# EAGLE schematic power_dist (EAGLE 9.6.0)
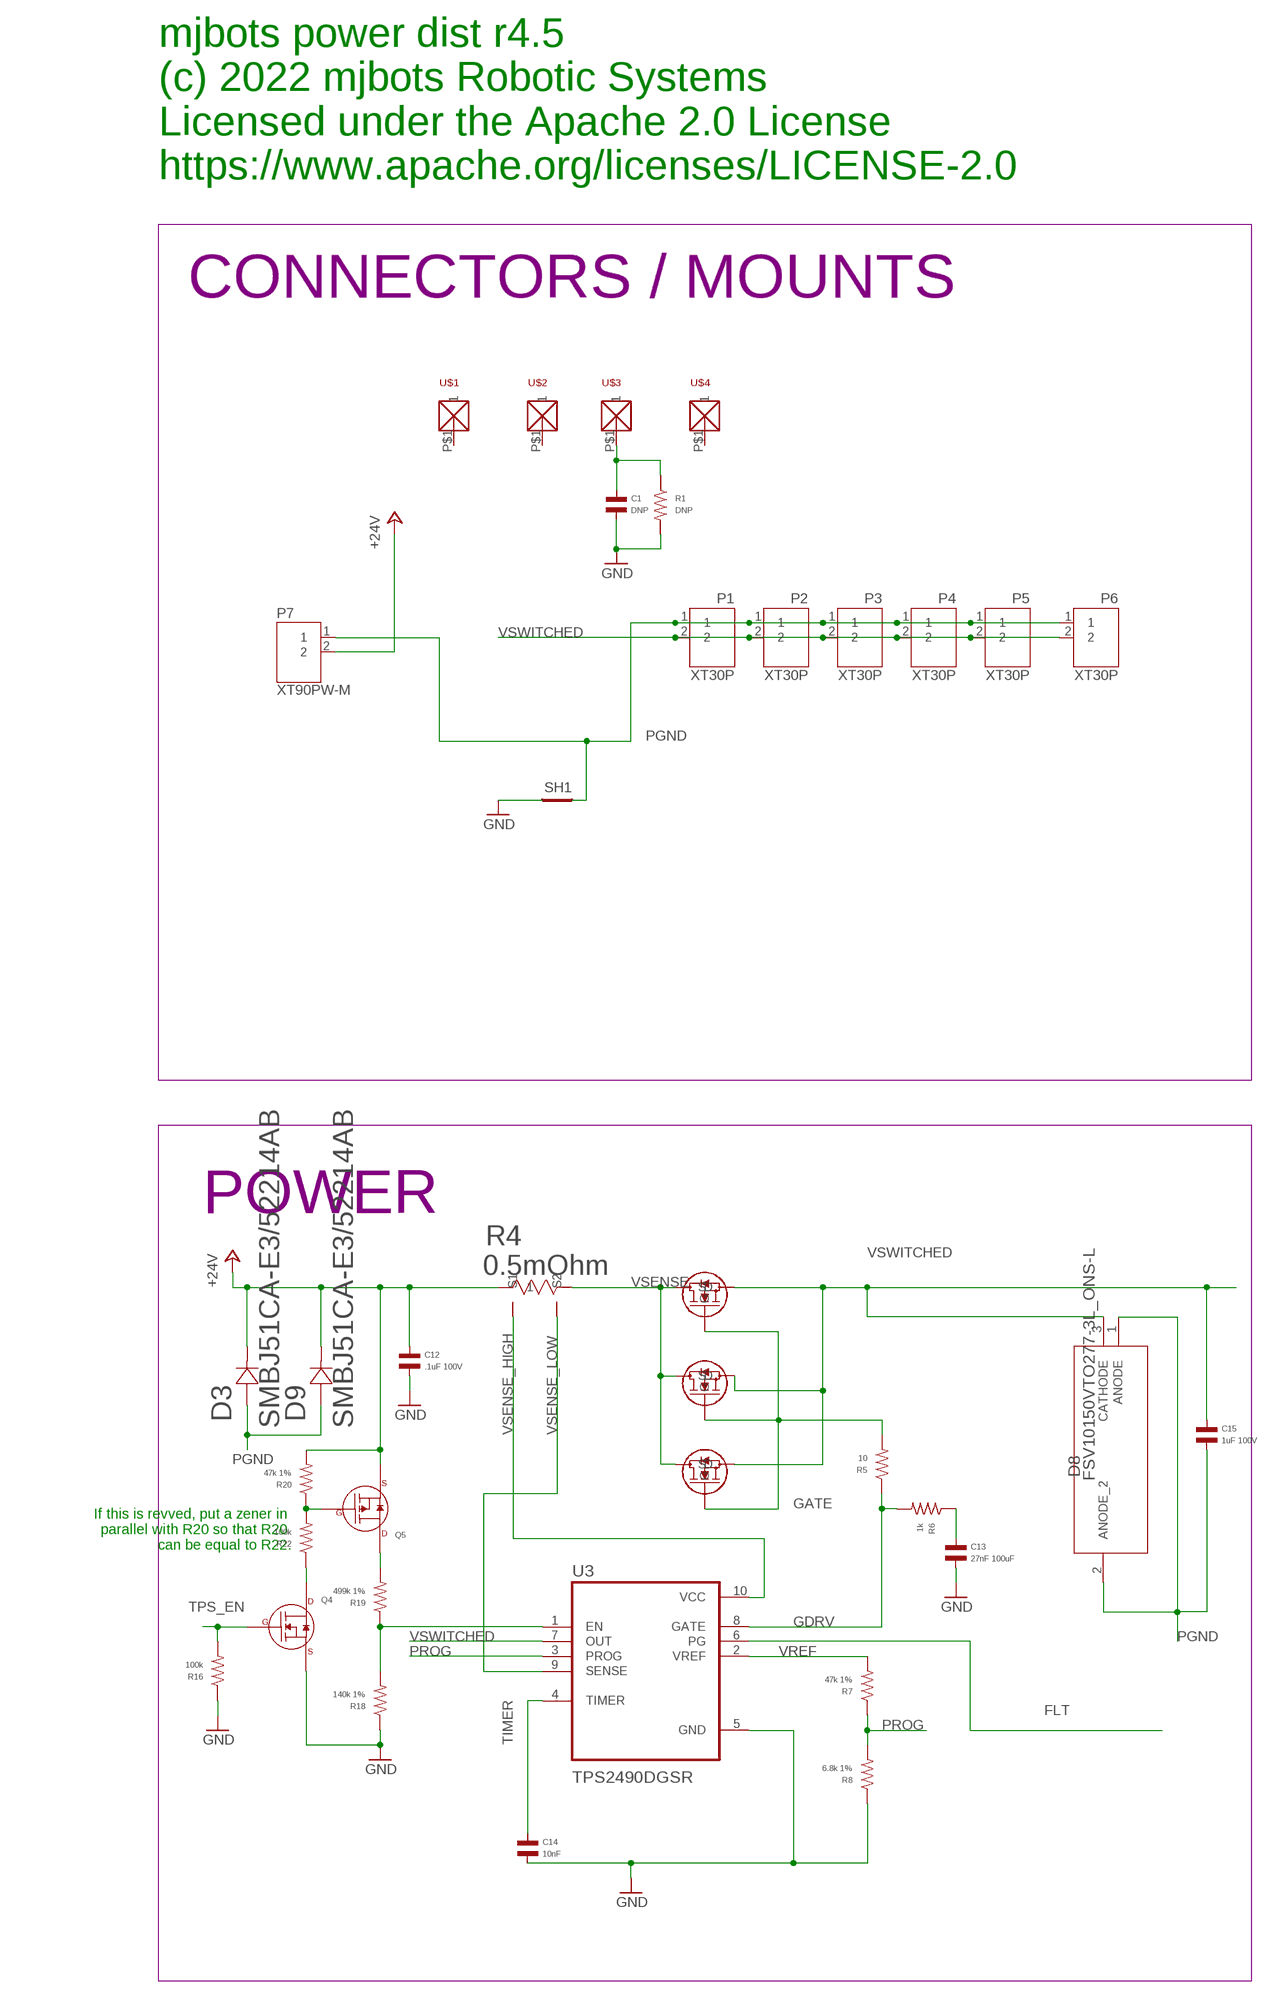
[diagram p0: schematic, sheet 1, part 1 of 2]
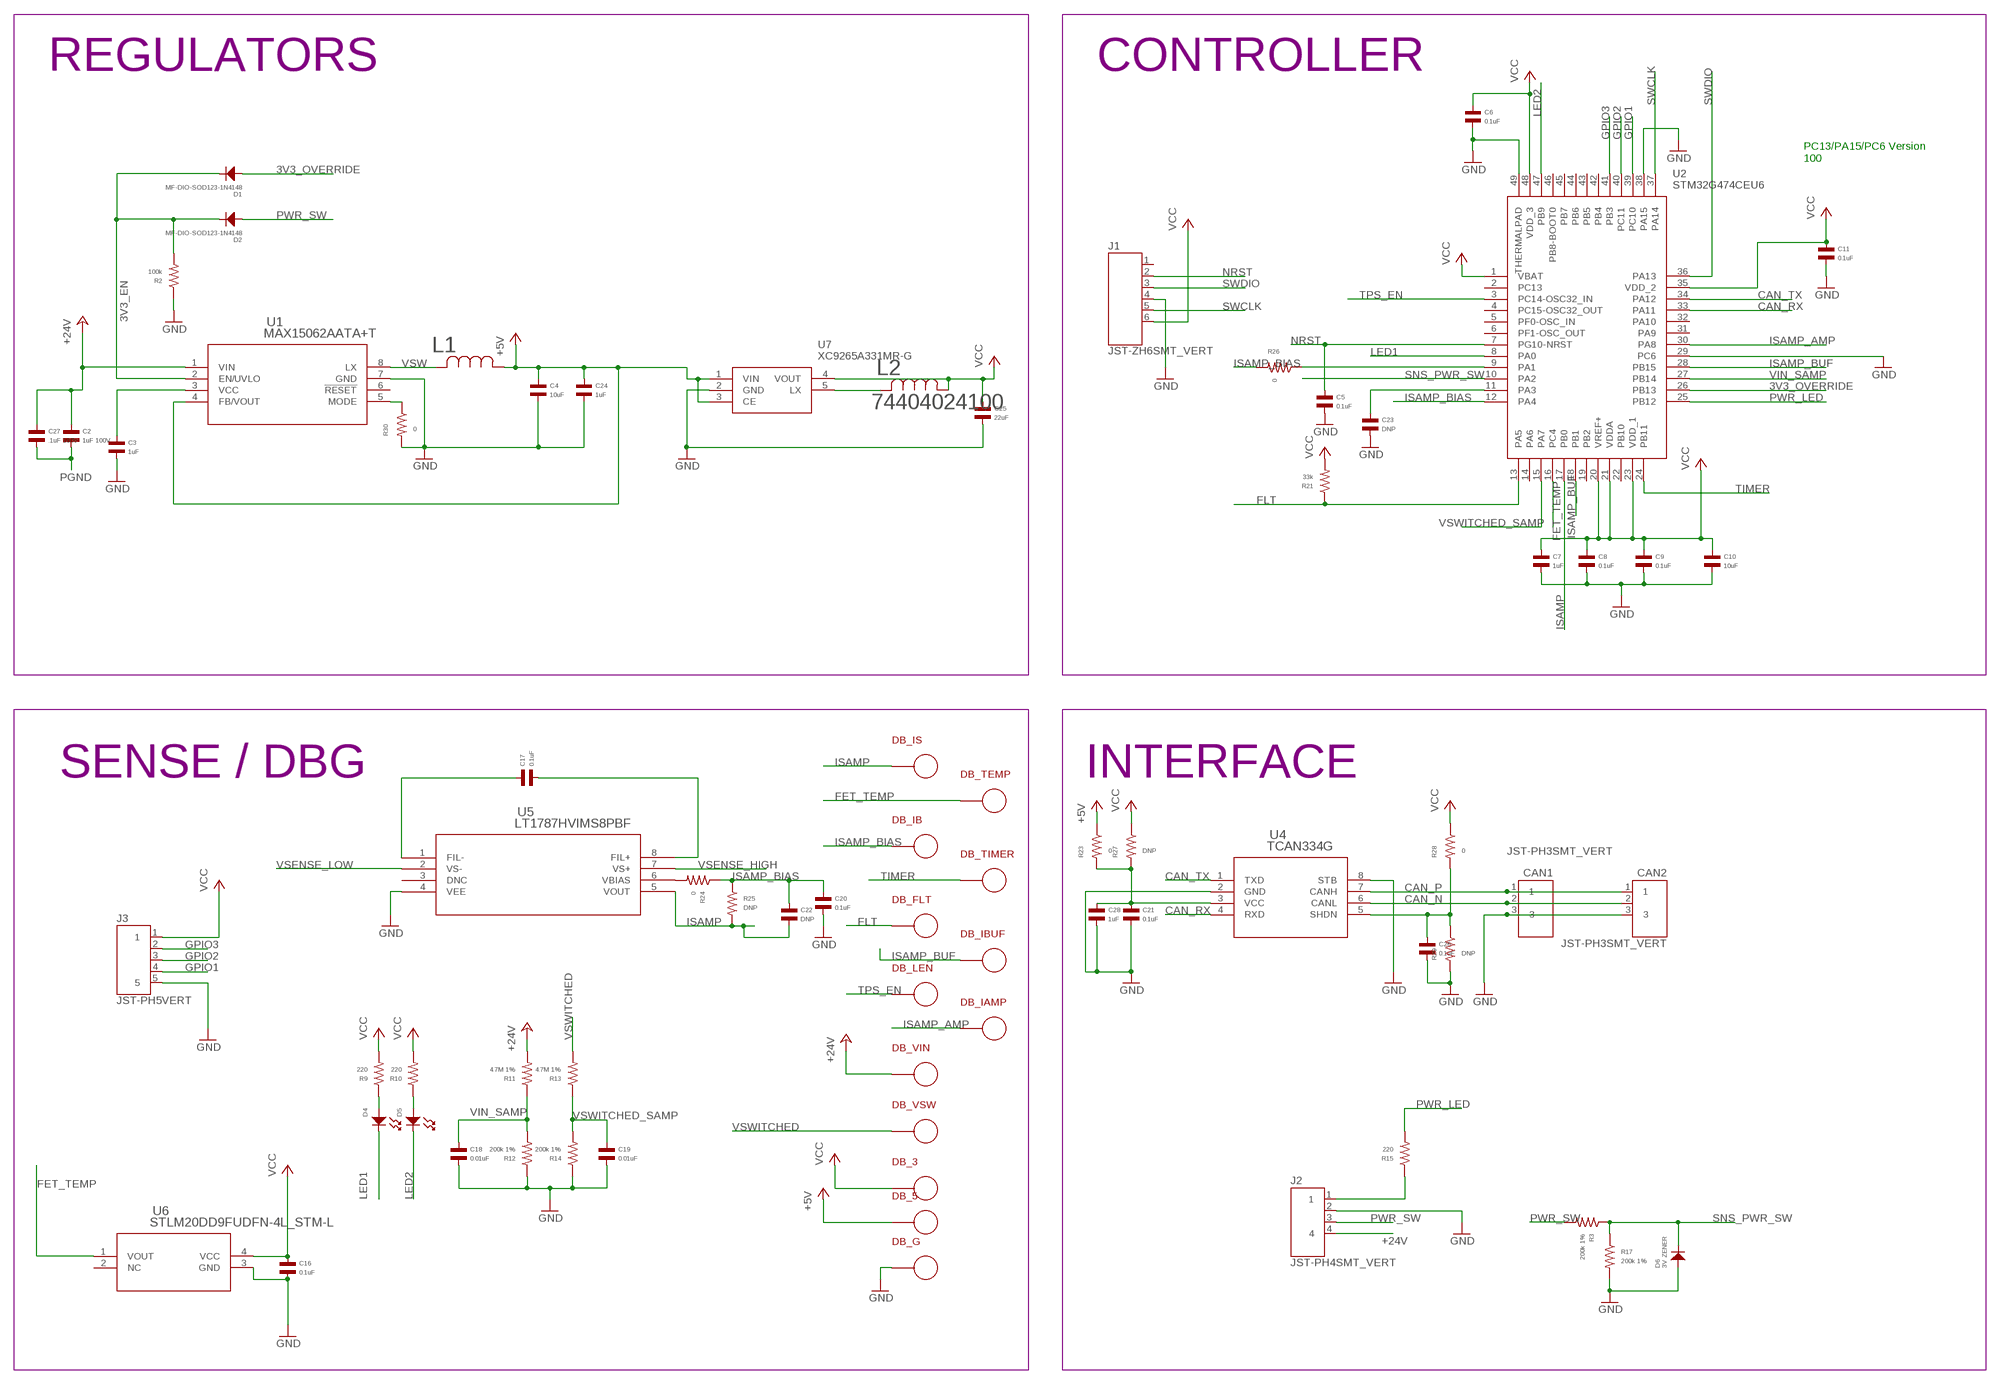
[diagram p1: schematic, sheet 1, part 2 of 2]

## Parts
C1  DNP  CAPACITOR_NP_0603  [C0603]
C2  1uF 100V  CAPACITOR_NP_0805  [C0805]
C3  1uF  CAPACITOR_NP_0603  [C0603]
C4  10uF  CAPACITOR_NP_1206  [C1206]
C5  0.1uF  CAPACITOR_NP_0603  [C0603]
C6  0.1uF  CAPACITOR_NP_0603  [C0603]
C7  1uF  CAPACITOR_NP_0603  [C0603]
C8  0.1uF  CAPACITOR_NP_0603  [C0603]
C9  0.1uF  CAPACITOR_NP_0603  [C0603]
C10  10uF  CAPACITOR_NP_1206  [C1206]
C11  0.1uF  CAPACITOR_NP_0603  [C0603]
C12  .1uF 100V  CAPACITOR_NP_0603  [C0603]
C13  27nF 100uF  CAPACITOR_NP_0603  [C0603]
C14  10nF  CAPACITOR_NP_0603  [C0603]
C15  1uF 100V  CAPACITOR_NP_0805  [C0805]
C16  0.1uF  CAPACITOR_NP_0603  [C0603]
C17  0.1uF  CAPACITOR_NP_0603  [C0603]
C18  0.01uF  CAPACITOR_NP_0603  [C0603]
C19  0.01uF  CAPACITOR_NP_0603  [C0603]
C20  0.1uF  CAPACITOR_NP_0603  [C0603]
C21  0.1uF  CAPACITOR_NP_0603  [C0603]
C22  DNP  CAPACITOR_NP_0603  [C0603]
C23  DNP  CAPACITOR_NP_0603  [C0603]
C24  1uF  CAPACITOR_NP_0402  [C0402]
C25  22uF  CAPACITOR_NP_1206  [C1206]
C26  0.1uF  CAPACITOR_NP_0603  [C0603]
C27  .1uF 100V  CAPACITOR_NP_0603  [C0603]
C28  1uF  CAPACITOR_NP_0603  [C0603]
CAN1  JST-PH3SMT_VERT  [JST_B3B_PH-SM4-TB(LF)(SN)]
CAN2  JST-PH3SMT_VERT  [JST_B3B_PH-SM4-TB(LF)(SN)]
D1  MF-DIO-SOD123-1N4148  DIODES_1N4148_SOD-123  [SOD-123]
D2  MF-DIO-SOD123-1N4148  DIODES_1N4148_SOD-123  [SOD-123]
D3  SMBJ51CA-E3/52214AB  [DIODE_DO-214AB]
D4  LED_SINGLE-0603  [LED0603]
D5  LED_SINGLE-0603  [LED0603]
D6  3V ZENER  DIODES_1N4148_SOD-123  [SOD-123]
D8  FSV10150VTO277-3L_ONS-L  [TO277-3L_ONS-L]
D9  SMBJ51CA-E3/52214AB  [DIODE_DO-214AB]
DB_3  PAD24AWG_PAD  [24AWG_PAD]
DB_5  PAD24AWG_PAD  [24AWG_PAD]
DB_FLT  PAD24AWG_PAD  [24AWG_PAD]
DB_G  PAD24AWG_PAD  [24AWG_PAD]
DB_IAMP  PAD24AWG_PAD  [24AWG_PAD]
DB_IB  PAD24AWG_PAD  [24AWG_PAD]
DB_IBUF  PAD24AWG_PAD  [24AWG_PAD]
DB_IS  PAD24AWG_PAD  [24AWG_PAD]
DB_LEN  PAD24AWG_PAD  [24AWG_PAD]
DB_TEMP  PAD24AWG_PAD  [24AWG_PAD]
DB_TIMER  PAD24AWG_PAD  [24AWG_PAD]
DB_VIN  PAD24AWG_PAD  [24AWG_PAD]
DB_VSW  PAD24AWG_PAD  [24AWG_PAD]
J1  JST-ZH6SMT_VERT  [JST_B6B-ZR-SM4-TF(LF)(SN)]
J2  JST-PH4SMT_VERT  [JST_B4B_PH-SM4-TB(LF)(SN)]
J3  JST-PH5VERT  [JST_B5B_PH-SM4-TB(LF)(SN)]
L1  SRN4018-220M  [IND_BOURNS_SRN4018]
L2  74404024100  [IND_4024100_WRE]
P1  XT30P  [XT30P]
P2  XT30P  [XT30P]
P3  XT30P  [XT30P]
P4  XT30P  [XT30P]
P5  XT30P  [XT30P]
P6  XT30P  [XT30P]
P7  XT90PW-M  [XT90PW-M]
Q1  PSMN4R8-100BSEJ  [D2PAK_SOT404_NEX]
Q2  PSMN4R8-100BSEJ  [D2PAK_SOT404_NEX]
Q3  PSMN4R8-100BSEJ  [D2PAK_SOT404_NEX]
Q4  N-CHANNEL_FET_SOT-23-3  [SOT-23-3]
Q5  P-CHANNEL_FET_SOT-23-3  [SOT-23-3]
R1  DNP  RESISTOR_0603  [R0603]
R2  100k  RESISTOR_0603  [R0603]
R3  200k 1%  RESISTOR_0603  [R0603]
R4  0.5mOhm  SENSE_RESISTOR2512  [SHUNT2512]
R5  10  RESISTOR_0603  [R0603]
R6  1k  RESISTOR_0603  [R0603]
R7  47k 1%  RESISTOR_0603  [R0603]
R8  6.8k 1%  RESISTOR_0603  [R0603]
R9  220  RESISTOR_0603  [R0603]
R10  220  RESISTOR_0603  [R0603]
R11  4.7M 1%  RESISTOR_0603  [R0603]
R12  200k 1%  RESISTOR_0603  [R0603]
R13  4.7M 1%  RESISTOR_0603  [R0603]
R14  200k 1%  RESISTOR_0603  [R0603]
R15  220  RESISTOR_0603  [R0603]
R16  100k  RESISTOR_0603  [R0603]
R17  200k 1%  RESISTOR_0603  [R0603]
R18  140k 1%  RESISTOR_0603  [R0603]
R19  499k 1%  RESISTOR_0603  [R0603]
R20  47k 1%  RESISTOR_0603  [R0603]
R21  33k  RESISTOR_0603  [R0603]
R22  100k  RESISTOR_0603  [R0603]
R23  0  RESISTOR_0603  [R0603]
R24  0  RESISTOR_0603  [R0603]
R25  DNP  RESISTOR_0603  [R0603]
R26  0  RESISTOR_0603  [R0603]
R27  DNP  RESISTOR_0603  [R0603]
R28  0  RESISTOR_0603  [R0603]
R29  DNP  RESISTOR_0603  [R0603]
R30  0  RESISTOR_0603  [R0603]
SH1  SHORTMEDIUM  [SHORT_TOP-MEDIUM]
U1  MAX15062AATA+T  [21-0487A_MXM]
U2  STM32G474CEU6  [QFN50P700X700X60-49N]
U3  TPS2490DGSR  [SOP50P490X110-10N]
U4  TCAN334G  [SOIC8]
U5  LT1787HVIMS8PBF  [MSOP-8_MS]
U6  STLM20DD9FUDFN-4L_STM-L  [UDFN-4L_STM-L]
U7  XC9265A331MR-G  [SOT95P280X130-5N]
U$1  MOUNT  [M2.5MOUNT]
U$2  MOUNT  [M2.5MOUNT]
U$3  MOUNT  [M2.5MOUNT]
U$4  MOUNT  [M2.5MOUNT]

## Nets
3V3_EN: D1.CATHODE D2.CATHODE R2.P$2 U1.2(EN/UVLO)
3V3_OVERRIDE: D1.ANODE U2.26(PB13)
+5V: C4.P$1 C24.P$1 DB_5.P$1 L1.1 R23.P$1 U1.4(FB/VOUT) U7.1(VIN) U7.3(CE)
+24V: C2.P$1 C12.P$1 C27.P$1 D3.P$1 D9.P$1 DB_VIN.P$1 J2.4 P7.2 Q5.P$2(SOURCE) R4.1 R11.P$2 R20.P$2 U1.1(VIN)
CAN_N: CAN1.2 CAN2.2 U4.6(CANL)
CAN_P: CAN1.1 CAN2.1 U4.7(CANH)
CAN_RX: U2.33(PA11) U4.4(RXD)
CAN_TX: U2.34(PA12) U4.1(TXD)
FET_TEMP: DB_TEMP.P$1 U2.16(PC4) U6.1(VOUT)
FLT: DB_FLT.P$1 R21.P$1 U2.13(PA5) U3.6(PG)
GATE: Q1.1(G) Q2.1(G) Q3.1(G) R5.P$2
GDRV: R5.P$1 R6.P$2 U3.8(GATE)
GND: C1.P$2 C3.P$2 C4.P$2 C5.P$2 C6.P$2 C7.P$2 C8.P$2 C9.P$2 C10.P$2 C11.P$2 C12.P$2 C13.P$2 C14.P$2 C16.P$2 C18.P$2 C19.P$2 C20.P$2 C21.P$2 C23.P$2 C24.P$2 C25.P$2 C26.P$2 C28.P$2 CAN1.3 CAN2.3 D6.ANODE DB_G.P$1 J1.4 J2.2 J3.5 Q4.P$2(SOURCE) R1.P$2 R2.P$1 R8.P$1 R12.P$1 R14.P$1 R16.P$1 R17.P$2 R18.P$1 R29.P$2 R30.P$2 SH1.1 U1.7(GND) U2.29(PC6) U2.38(PA15) U2.49(THERMALPAD) U3.5(GND) U4.2(GND) U4.8(STB) U5.4(VEE) U6.3(GND) U7.2(GND)
GPIO1: J3.4 U2.39(PC10)
GPIO2: J3.3 U2.40(PC11)
GPIO3: J3.2 U2.41(PB3)
ISAMP: C22.P$2 DB_IS.P$1 R25.P$2 U2.17(PB0) U5.5(VOUT)
ISAMP_AMP: DB_IAMP.P$1 U2.30(PA8)
ISAMP_BIAS: C20.P$1 C22.P$1 DB_IB.P$1 R24.P$1 R25.P$1 R26.P$2 U2.12(PA4)
ISAMP_BUF: DB_IBUF.P$1 U2.18(PB1) U2.28(PB15)
LED1: D4.CATHODE U2.8(PA0)
LED2: D5.CATHODE U2.47(PB9)
N$1: R30.P$1 U1.5(MODE)
N$2: J2.1 R15.P$1
N$3: R24.P$2 U5.6(VBIAS)
N$4: C3.P$1 U1.3(VCC)
N$5: C23.P$1 U2.11(PA3)
N$6: C17.P$1 U5.1(FIL-)
N$7: C17.P$2 U5.8(FIL+)
N$8: D4.ANODE R9.P$1
N$9: C13.P$1 R6.P$1
N$10: R26.P$1 U2.9(PA1)
N$11: Q5.P$3(DRAIN) R19.P$2
N$12: R18.P$2 R19.P$1 U3.1(EN)
N$13: Q4.P$3(DRAIN) R22.P$1
N$14: D5.ANODE R10.P$1
N$15: C1.P$1 R1.P$1 U$3.P$1
N$16: Q5.P$1(GATE) R20.P$1 R22.P$2
N$17 [power]: C21.P$1 C28.P$1 R23.P$2 R27.P$2 U4.3(VCC)
N$18: L2.2 U7.5(LX)
N$19: C26.P$1 R28.P$2 R29.P$1 U4.5(SHDN)
NRST: C5.P$1 J1.2 U2.7(PG10-NRST)
PGND: C2.P$2 C15.P$2 C27.P$2 D3.P$2 D8.1(ANODE) D8.2(ANODE_2) D9.P$2 P1.1 P2.1 P3.1 P4.1 P5.1 P6.1 P7.1 SH1.2
PROG: R7.P$1 R8.P$2 U3.3(PROG)
PWR_LED: R15.P$2 U2.25(PB12)
PWR_SW: D2.ANODE J2.3 R3.P$2
SNS_PWR_SW: D6.CATHODE R3.P$1 R17.P$1 U2.10(PA2)
SWCLK: J1.5 U2.37(PA14)
SWDIO: J1.3 U2.36(PA13)
TIMER: C14.P$1 DB_TIMER.P$1 U2.24(PB11) U3.4(TIMER)
TPS_EN: DB_LEN.P$1 Q4.P$1(GATE) R16.P$2 U2.3(PC14-OSC32_IN)
VCC [power]: C6.P$1 C7.P$1 C8.P$1 C9.P$1 C10.P$1 C11.P$1 C16.P$1 C25.P$1 DB_3.P$1 J1.6 J3.1 L2.1 R9.P$2 R10.P$2 R21.P$2 R27.P$1 R28.P$1 U2.1(VBAT) U2.20(VREF+) U2.21(VDDA) U2.23(VDD_1) U2.35(VDD_2) U2.48(VDD_3) U6.4(VCC) U7.4(VOUT)
VIN_SAMP: C18.P$1 R11.P$1 R12.P$2 U2.27(PB14)
VREF: R7.P$2 U3.2(VREF)
VSENSE: Q1.2(D) Q2.2(D) Q3.2(D) R4.2
VSENSE_HIGH: R4.3(S1) U3.10(VCC) U5.7(VS+)
VSENSE_LOW: R4.4(S2) U3.9(SENSE) U5.2(VS-)
VSW: L1.2 U1.8(LX)
VSWITCHED: C15.P$1 D8.3(CATHODE) DB_VSW.P$1 P1.2 P2.2 P3.2 P4.2 P5.2 P6.2 Q1.3(S) Q2.3(S) Q3.3(S) R13.P$2 U3.7(OUT)
VSWITCHED_SAMP: C19.P$1 R13.P$1 R14.P$2 U2.15(PA7)
Unconnected: J1.1 U1.6(!RESET) U2.2(PC13) U2.4(PC15-OSC32_OUT) U2.5(PF0-OSC_IN) U2.6(PF1-OSC_OUT) U2.14(PA6) U2.19(PB2) U2.22(PB10) U2.31(PA9) U2.32(PA10) U2.42(PB4) U2.43(PB5) U2.44(PB6) U2.45(PB7) U2.46(PB8-BOOT0) U5.3(DNC) U6.2(NC) U$1.P$1 U$2.P$1 U$4.P$1

## Notes on the sheet
- mjbots power dist r4.5
  (c) 2022 mjbots Robotic Systems
  Licensed under the Apache 2.0 License
  https://www.apache.org/licenses/LICENSE-2.0
- CONNECTORS / MOUNTS | REGULATORS | CONTROLLER
- PC13/PA15/PC6 Version
  100
- POWER | SENSE / DBG | INTERFACE
- If this is revved, put a zener in 
  parallel with R20 so that R20 
  can be equal to R22.

## Library data of the parts
C1 = mfpassives:CAPACITOR_NP: Library: MF_Passives Description: Device for Non-Polarized Capacitors. Manufacture part number (MPN) can be added via Attributes. Check https://factory.macrofab.com/parts for the house parts list.; POPULATE: 0
C2 C15 = mfpassives:CAPACITOR_NP: Library: MF_Passives Description: Device for Non-Polarized Capacitors. Manufacture part number (MPN) can be added via Attributes. Check https://factory.macrofab.com/parts for the house parts list.; MF: MURATA; MPN: GCM21BC72A105KE36L; POPULATE: 1
C3 C7 C28 = mfpassives:CAPACITOR_NP: Library: MF_Passives Description: Device for Non-Polarized Capacitors. Manufacture part number (MPN) can be added via Attributes. Check https://factory.macrofab.com/parts for the house parts list.; HOUSEPART: 1; MPN: MF-CAP-0603-1uF; POPULATE: 1
C4 C10 = mfpassives:CAPACITOR_NP: Library: MF_Passives Description: Device for Non-Polarized Capacitors. Manufacture part number (MPN) can be added via Attributes. Check https://factory.macrofab.com/parts for the house parts list.; HOUSEPART: 1; MPN: MF-CAP-1206-10uF; POPULATE: 1
C5 C6 C8 C9 C11 C16 C17 C20 C21 C26 = mfpassives:CAPACITOR_NP: Library: MF_Passives Description: Device for Non-Polarized Capacitors. Manufacture part number (MPN) can be added via Attributes. Check https://factory.macrofab.com/parts for the house parts list.; HOUSEPART: 1; MPN: MF-CAP-0603-0.1uF; POPULATE: 1
C12 C27 = mfpassives:CAPACITOR_NP: Library: MF_Passives Description: Device for Non-Polarized Capacitors. Manufacture part number (MPN) can be added via Attributes. Check https://factory.macrofab.com/parts for the house parts list.; HOUSEPART: 0; MPN: GRM188R72A104KA35D; POPULATE: 1
C13 = mfpassives:CAPACITOR_NP: Library: MF_Passives Description: Device for Non-Polarized Capacitors. Manufacture part number (MPN) can be added via Attributes. Check https://factory.macrofab.com/parts for the house parts list.; HOUSEPART: 0; MPN: C0603C273K1RAC7867; POPULATE: 1
C14 C18 C19 = mfpassives:CAPACITOR_NP: Library: MF_Passives Description: Device for Non-Polarized Capacitors. Manufacture part number (MPN) can be added via Attributes. Check https://factory.macrofab.com/parts for the house parts list.; HOUSEPART: 1; MPN: MF-CAP-0603-0.01uF; POPULATE: 1
C22 C23 = mfpassives:CAPACITOR_NP: Library: MF_Passives Description: Device for Non-Polarized Capacitors. Manufacture part number (MPN) can be added via Attributes. Check https://factory.macrofab.com/parts for the house parts list.; HOUSEPART: 1; POPULATE: 0
C24 = mfpassives:CAPACITOR_NP: Library: MF_Passives Description: Device for Non-Polarized Capacitors. Manufacture part number (MPN) can be added via Attributes. Check https://factory.macrofab.com/parts for the house parts list.; HOUSEPART: 1; MPN: MF-CAP-0402-1uF; POPULATE: 1
C25 = mfpassives:CAPACITOR_NP: Library: MF_Passives Description: Device for Non-Polarized Capacitors. Manufacture part number (MPN) can be added via Attributes. Check https://factory.macrofab.com/parts for the house parts list.; MF: Samsung; MPN: CL31B226KPHNNNE; POPULATE: 1
CAN1 CAN2 = precharge:JST-PH3; MF: JST; MPN: B3B-PH-SM4-TB(LF)(SN); POPULATE: 1
D1 D2 = mfdiscretesemi:DIODES: Library: MF_Discrete_Semiconductor Description: Device for Single Packaged Diodes.; HOUSEPART: YES; MPN: MF-DIO-SOD123-1N4148; POPULATE: 1; URL: https://factory.macrofab.com/part/MF-DIO-SOD123-1N4148
D3 D9 = power_dist:SMBJ51CA-E3/52; MPN: SMC5K51A-M3/I; POPULATE: 1
D4 D5 = mfleds:LED_SINGLE: Library: MF_LEDs Description: Device for Single LED Packages. Manufacture part number (MFG#) can be added via Attributes.; HOUSEPART: 1; MPN: MF-LED-0603-RED; POPULATE: 1
D6 = mfdiscretesemi:DIODES: Library: MF_Discrete_Semiconductor Description: Device for Single Packaged Diodes.; MPN: MMSZ4682T1G; POPULATE: 1; VALUE: MF-DIO-SOD123-1N4148
D8 = power_dist:FSV10150V; BUILT_BY: EMA_Jessica; COPYRIGHT: Copyright (C) 2018 Accelerated Designs. All rights reserved; MANUFACTURER_PART_NUMBER: FSV10150V; MPN: FSV10150V; POPULATE: 1; SOURCELIBRARY: ON_Semiconductor_2019-12-30; VENDOR: ON Semiconductor
DB_3 DB_5 DB_FLT DB_G DB_IAMP DB_IB DB_IBUF DB_IS DB_LEN DB_TEMP DB_TIMER DB_VIN DB_VSW = precharge:PAD; POPULATE: 0
J1 = precharge:JST-ZH6; MF: JST; MPN: B6B-ZR-SM4-TF(LF)(SN); POPULATE: 1
J2 = precharge:JST-PH4; MF: JST; MPN: B4B-PH-SM4-TB(LF)(SN); POPULATE: 1
J3 = power_dist:JST-PH5; MF: JST; MPN: B5B-PH-SM4-TB(LF)(SN); POPULATE: 1
L1 = controller:SRN4018-220M; MANUFACTURER_PART_NUMBER: 74404042470; MF: Wurth Electronics; MPN: 74404042470; POPULATE: 1; VENDOR: Wurth
L2 = moteus_hp:74404024100; COPYRIGHT: Copyright (C) 2022 Ultra Librarian. All rights reserved.; DIGI-KEY_PART_NUMBER_1: 732-5428-2-ND; DIGI-KEY_PART_NUMBER_2: 732-5428-1-ND; DIGI-KEY_PART_NUMBER_3: 732-5428-6-ND; MANUFACTURER_PART_NUMBER: 74404024100; MF: Wurth Electronics; MFR_NAME: Wurth Electronics; MPN: 74404024100; POPULATE: 1
P1-P6 = precharge:XT30; MF: AMASS; MPN: XT30UPB-F; POPULATE: 1
P7 = power_dist:XT90; POPULATE: 1
Q1-Q3 = power_dist:PSMN4R8-100BSEJ; BUILT_BY: EMA_Cory; COPYRIGHT: Copyright (C) 2018 Accelerated Designs. All rights reserved; DATASHEET: https://assets.nexperia.com/documents/data-sheet/PSMN4R8-100BSE.pdf; MANUFACTURER_PART_NUMBER: PSMN3R7-100BSE; MPN: PSMN3R7-100BSE; POPULATE: 1; SOURCELIBRARY: Nexperia_2020-02-27; VENDOR: Nexperia
Q4 = mfdiscretesemi:N-CHANNEL_FET: Library: MF_Discrete_Semiconductor Description: Device for Single N-Channel Mosfet. Manufacture part number (MFG#) can be added via Attributes.; HOUSEPART: NO; MPN: BSS123; POPULATE: 1
Q5 = mfdiscretesemi:P-CHANNEL_FET: Library: MF_Discrete_Semiconductor Description: Device for Single P-Channel Mosfet. Manufacture part number (MFG#) can be added via Attributes.; HOUSEPART: NO; MPN: ZXMP10A13FTA; POPULATE: 1
R1 = mfpassives:RESISTOR: Library: MF_Passives Description: Device for Resistors. Manufacture part number (MPN), Voltage, Tolerance, and Wattage Rating can be added via Attributes. Check https://factory.macrofab.com/parts for the house parts list.; POPULATE: 0
R2 R16 R22 = mfpassives:RESISTOR: Library: MF_Passives Description: Device for Resistors. Manufacture part number (MPN), Voltage, Tolerance, and Wattage Rating can be added via Attributes. Check https://factory.macrofab.com/parts for the house parts list.; HOUSEPART: 1; MPN: MF-RES-0603-100K; POPULATE: 1
R3 R12 R14 R17 = mfpassives:RESISTOR: Library: MF_Passives Description: Device for Resistors. Manufacture part number (MPN), Voltage, Tolerance, and Wattage Rating can be added via Attributes. Check https://factory.macrofab.com/parts for the house parts list.; HOUSEPART: 0; MPN: RC0603FR-07200KL; POPULATE: 1
R4 = power_dist:SENSE_RESISTOR; MF: VISHAY DALE; MPN: WSLF2512L5000FEA; POPULATE: 1
R5 = mfpassives:RESISTOR: Library: MF_Passives Description: Device for Resistors. Manufacture part number (MPN), Voltage, Tolerance, and Wattage Rating can be added via Attributes. Check https://factory.macrofab.com/parts for the house parts list.; HOUSEPART: 1; MPN: MF-RES-0603-10; POPULATE: 1
R6 = mfpassives:RESISTOR: Library: MF_Passives Description: Device for Resistors. Manufacture part number (MPN), Voltage, Tolerance, and Wattage Rating can be added via Attributes. Check https://factory.macrofab.com/parts for the house parts list.; HOUSEPART: 1; MPN: MF-RES-0603-1K; POPULATE: 1
R7 R20 = mfpassives:RESISTOR: Library: MF_Passives Description: Device for Resistors. Manufacture part number (MPN), Voltage, Tolerance, and Wattage Rating can be added via Attributes. Check https://factory.macrofab.com/parts for the house parts list.; HOUSEPART: 0; MPN: RC0603FR-0747KL; POPULATE: 1
R8 = mfpassives:RESISTOR: Library: MF_Passives Description: Device for Resistors. Manufacture part number (MPN), Voltage, Tolerance, and Wattage Rating can be added via Attributes. Check https://factory.macrofab.com/parts for the house parts list.; HOUSEPART: 0; MPN: RC0603FR-076K8L; POPULATE: 1
R9 R10 R15 = mfpassives:RESISTOR: Library: MF_Passives Description: Device for Resistors. Manufacture part number (MPN), Voltage, Tolerance, and Wattage Rating can be added via Attributes. Check https://factory.macrofab.com/parts for the house parts list.; HOUSEPART: 1; MPN: MF-RES-0603-220; POPULATE: 1
R11 R13 = mfpassives:RESISTOR: Library: MF_Passives Description: Device for Resistors. Manufacture part number (MPN), Voltage, Tolerance, and Wattage Rating can be added via Attributes. Check https://factory.macrofab.com/parts for the house parts list.; HOUSEPART: 0; MPN: RC0603FR-074M7L; POPULATE: 1
R18 = mfpassives:RESISTOR: Library: MF_Passives Description: Device for Resistors. Manufacture part number (MPN), Voltage, Tolerance, and Wattage Rating can be added via Attributes. Check https://factory.macrofab.com/parts for the house parts list.; HOUSEPART: 0; MPN: RC0603FR-07140KL; POPULATE: 1
R19 = mfpassives:RESISTOR: Library: MF_Passives Description: Device for Resistors. Manufacture part number (MPN), Voltage, Tolerance, and Wattage Rating can be added via Attributes. Check https://factory.macrofab.com/parts for the house parts list.; HOUSEPART: 0; MPN: RC0603FR-07499KL; POPULATE: 1
R21 = mfpassives:RESISTOR: Library: MF_Passives Description: Device for Resistors. Manufacture part number (MPN), Voltage, Tolerance, and Wattage Rating can be added via Attributes. Check https://factory.macrofab.com/parts for the house parts list.; HOUSEPART: 1; MPN: RC0603FR-0733KL; POPULATE: 1
R23 R24 R26 R28 R30 = mfpassives:RESISTOR: Library: MF_Passives Description: Device for Resistors. Manufacture part number (MPN), Voltage, Tolerance, and Wattage Rating can be added via Attributes. Check https://factory.macrofab.com/parts for the house parts list.; HOUSEPART: 1; MPN: MF-RES-0603-0; POPULATE: 1
R25 = mfpassives:RESISTOR: Library: MF_Passives Description: Device for Resistors. Manufacture part number (MPN), Voltage, Tolerance, and Wattage Rating can be added via Attributes. Check https://factory.macrofab.com/parts for the house parts list.; HOUSEPART: 1; POPULATE: 0
R27 R29 = mfpassives:RESISTOR: Library: MF_Passives Description: Device for Resistors. Manufacture part number (MPN), Voltage, Tolerance, and Wattage Rating can be added via Attributes. Check https://factory.macrofab.com/parts for the house parts list.; HOUSEPART: 1; MPN: MF-RES-0603-0; POPULATE: 0
SH1 = shorts:SHORT: Short between two nets; POPULATE: 0
U1 = power_dist:MAX15062AATA+T; BUILT_BY: EMA_Jessica; COPYRIGHT: Copyright (C) 2018 Accelerated Designs. All rights reserved; MANUFACTURER_PART_NUMBER: MAX15062BATA+T; MF: Maxim; MPN: MAX15062BATA+T; POPULATE: 1; REVISION: 1; SOURCELIBRARY: Maxim_DP_2018-06-12; VENDOR: Maxim Integrated Products
U2 = power_dist:STM32G474CEU6: STMICROELECTRONICS - STM32G474CEU6 - MCU, 32BIT, 170MHZ, UFQFPN-48 Source: Datasheet <https://componentsearchengine.com/Datasheets/1/STM32G474CEU6.pdf>; DESCRIPTION: STMICROELECTRONICS - STM32G474CEU6 - MCU, 32BIT, 170MHZ, UFQFPN-48; HEIGHT: 0.6mm; MANUFACTURER_NAME: STMicroelectronics; MANUFACTURER_PART_NUMBER: STM32G474CEU6; MF: ST; MOUSER_PART_NUMBER: 511-STM32G474CEU6; MOUSER_PRICE-STOCK: https://www.mouser.com/Search/Refine.aspx?Keyword=511-STM32G474CEU6; MPN: STM32G474CEU6; POPULATE: 1
U3 = TPS2490DGSR:TPS2490DGSR; DESCRIPTION: 9-V to 80-V hot swap controller with power limiting and latch off 10-VSSOP -40 to 85; DIGI-KEY_PART_NUMBER: 296-26924-1-ND; MF: Texas Instruments; MP: TPS2490DGSR; MPN: TPS2490DGSR; PACKAGE: VSSOP-10 Texas Instruments; POPULATE: 1; PURCHASE-URL: https://pricing.snapeda.com/search/part/TPS2490DGSR/?ref=eda
U4 = precharge:TCAN334G; MF: TI; MPN: TCAN1057AEVDRQ1; POPULATE: 1
U5 = LT1787HVIMS8PBF:LT1787HVIMS8PBF; DESCRIPTION: Current Sense Amplifier 1 Circuit 8-MSOP; DIGI-KEY_PART_NUMBER: LT1787HVIMS8#PBF-ND; MF: Linear Technology; MP: LT1787HVIMS8#PBF; MPN: LT1787HVIMS8; PACKAGE: MSOP-8 Linear Technology; POPULATE: 1; PURCHASE-URL: https://pricing.snapeda.com/search/part/LT1787HVIMS8#PBF/?ref=eda
U6 = power_dist:STLM20DD9F; BUILT_BY: EMA_Jessica; COPYRIGHT: Copyright (C) 2018 Accelerated Designs. All rights reserved; MANUFACTURER_PART_NUMBER: STLM20DD9F; MPN: STLM20DD9F; POPULATE: 1; SOURCELIBRARY: Update_to_database_2020-11-24; VENDOR: STMicroelectronics
U7 = XC9265A331MR-G:XC9265A331MR-G: Switching Voltage Regulators Ultra Low Power PFM DCDC Converter Source: Datasheet <https://www.torexsemi.com/file/xc9265/XC9265.pdf>; DESCRIPTION: Switching Voltage Regulators Ultra Low Power PFM DCDC Converter; HEIGHT: 1.3mm; MANUFACTURER_NAME: Torex; MANUFACTURER_PART_NUMBER: XC9265A331MR-G; MF: Torex; MOUSER_PART_NUMBER: 865-XC9265A331MR-G; MOUSER_PRICE-STOCK: https://www.mouser.co.uk/ProductDetail/Torex-Semiconductor/XC9265A331MR-G?qs=AsjdqWjXhJ9U1u7bKcUHSA%3D%3D; MPN: XC9265A331MR-G; POPULATE: 1
U$1-U$4 = power_dist:MOUNT; POPULATE: 0

## Net classes
1 power: width 0.254 mm